# EAGLE design AK9753 Human Movement Sensor (EAGLE 9.5.2)
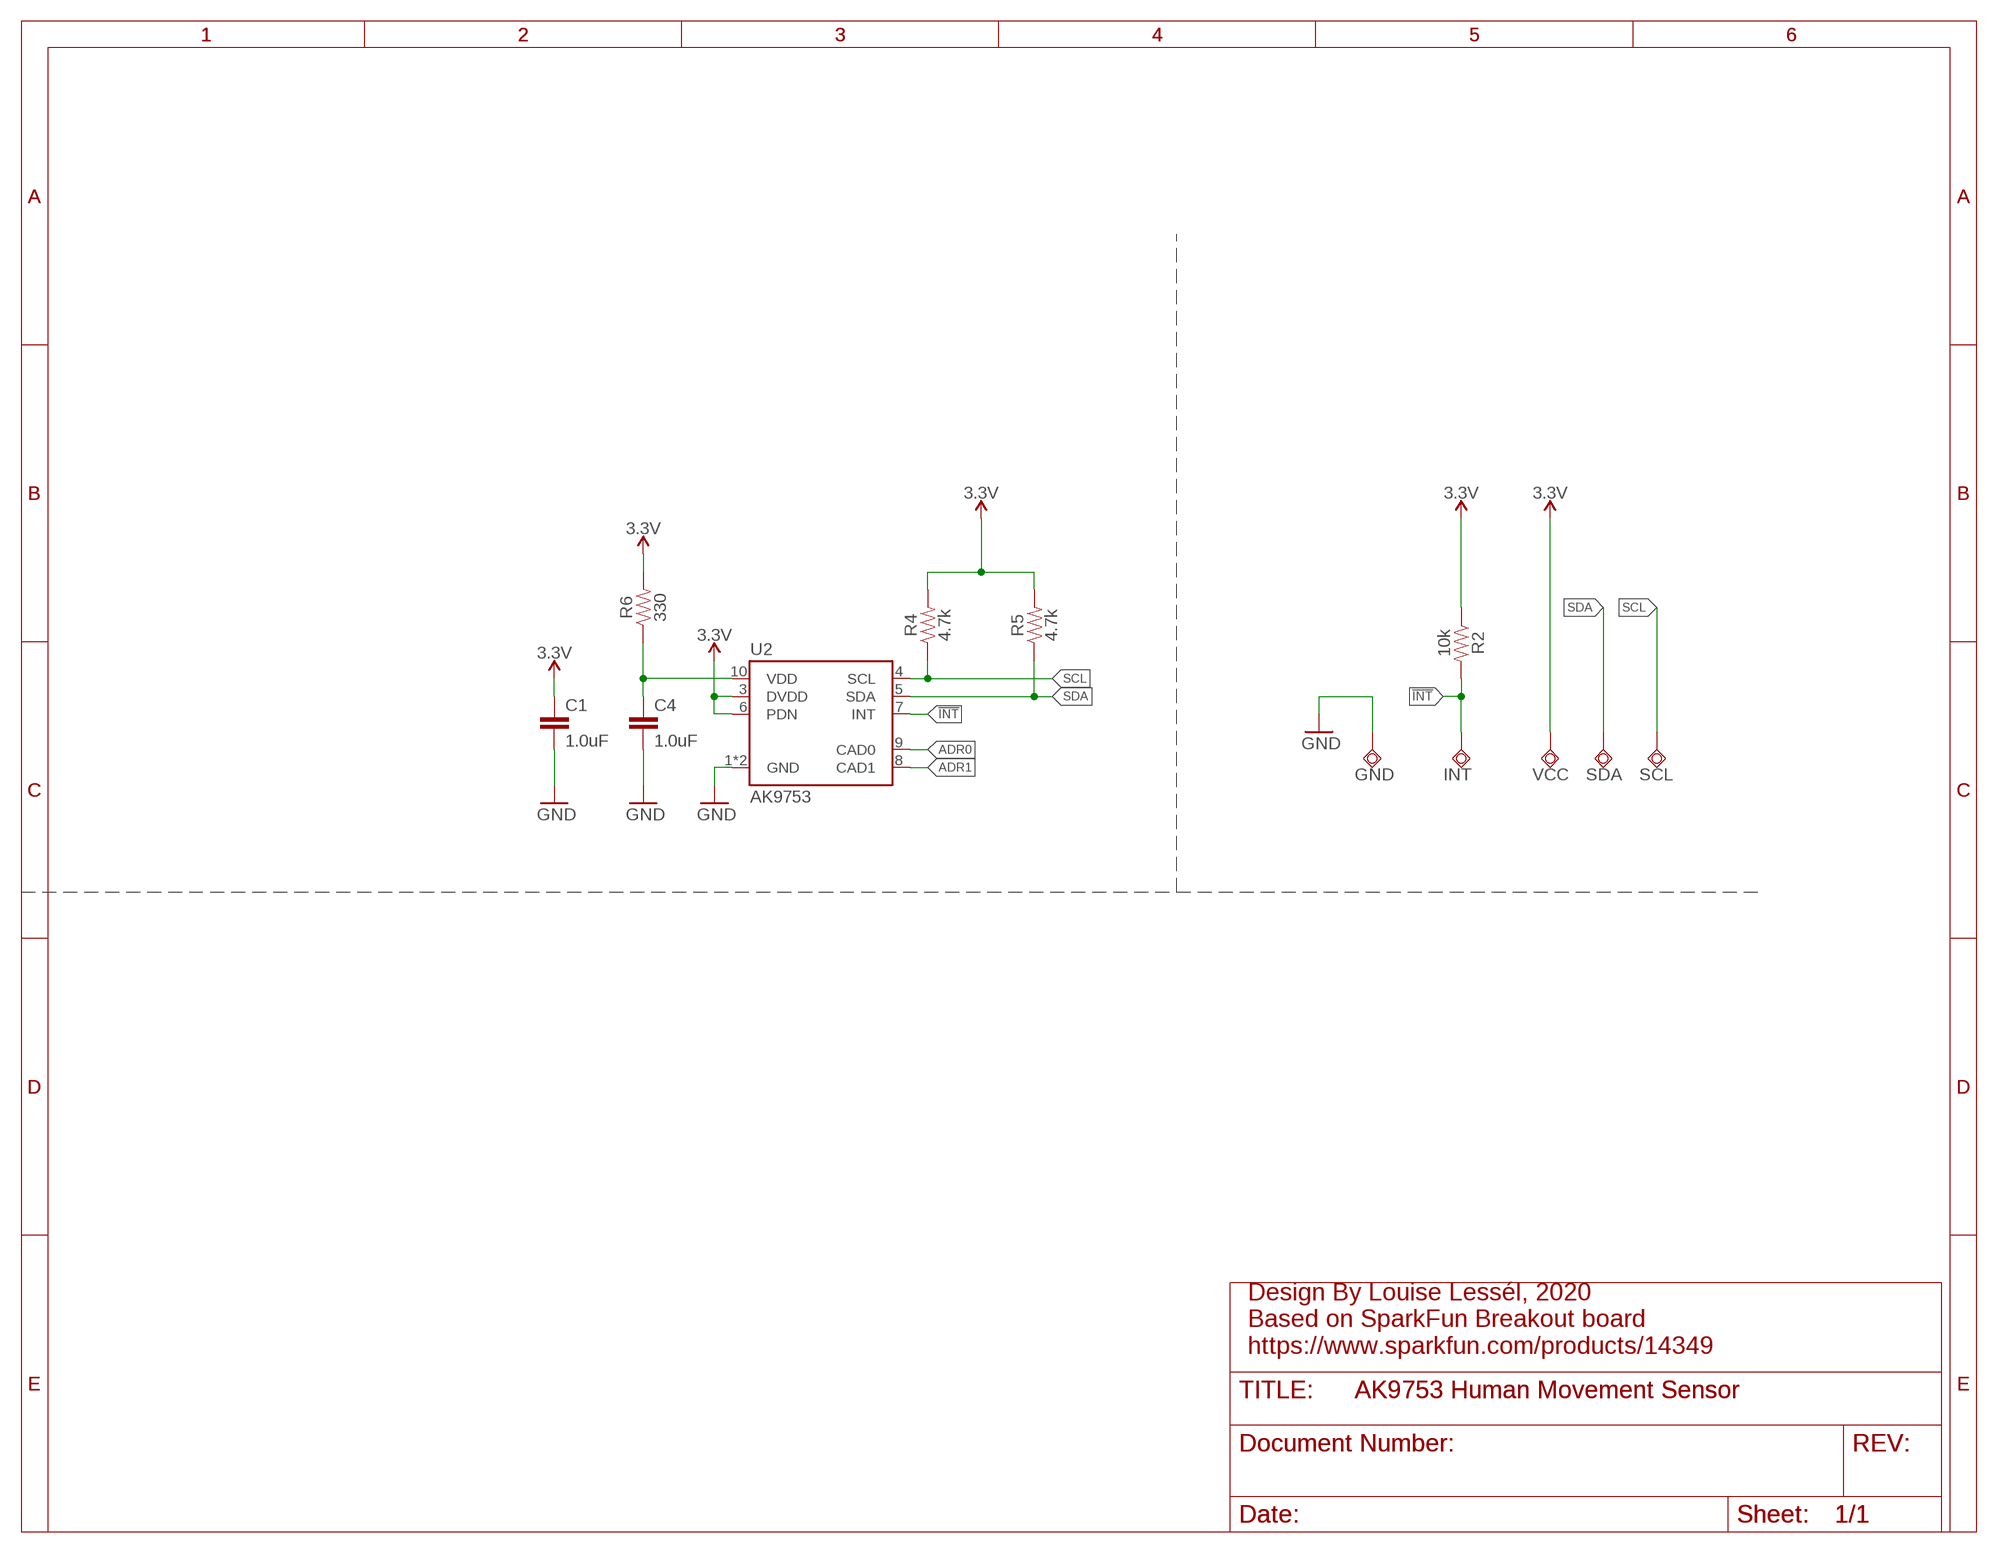
[diagram p0: schematic, sheet 1]

## Parts
C1  1.0uF  1.0UF-0603-16V-10%  [0603]
C4  1.0uF  1.0UF-0603-16V-10%  [0603]
GND  TPSQTP20R  [TP20R]
INT  TPSQTP20R  [TP20R]
R2  10k  10KOHM-0603-1/10W-1%  [0603]
R4  4.7k  4.7KOHM-0603-1/10W-1%  [0603]
R5  4.7k  4.7KOHM-0603-1/10W-1%  [0603]
R6  330  330OHM-0603-1/10W-1%  [0603]
SCL  TPSQTP20R  [TP20R]
SDA  TPSQTP20R  [TP20R]
U2  AK9753  AK9750"  [SON10]
VCC  TPSQTP20R  [TP20R]

## Nets
3.3V: C1.1 R2.1 R4.2 R5.2 R6.2 U2.3(DVDD) U2.6(PDN) VCC.TP
!INT: INT.TP R2.2 U2.7(INT)
ADR0: U2.9(CAD0)
ADR1: U2.8(CAD1)
GND: C1.2 C4.2 GND.TP U2.1(GND) U2.2(GND)
SCL: R4.1 SCL.TP U2.4(SCL)
SDA: R5.1 SDA.TP U2.5(SDA)
VDD: C4.1 R6.1 U2.10(VDD)

## Notes on the sheet
- Design By Louise Lessél, 2020
  Based on SparkFun Breakout board
  https://www.sparkfun.com/products/14349

## Library data of the parts
C1 C4 = SparkFun-Capacitors:1.0UF: 1µF ceramic capacitors A capacitor is a passive two-terminal electrical component used to store electrical energy temporarily in an electric field.; PROD_ID: CAP-00868
GND INT SCL SDA VCC = testpad:TPSQ: Test pad
R2 = SparkFun-Resistors:10KOHM: 10kΩ resistor A resistor is a passive two-terminal electrical component that implements electrical resistance as a circuit element. Resistors act to reduce current flow, and, at the same time, act to lower voltage levels within circuits. - Wikipedia; PROD_ID: RES-00824
R4 R5 = SparkFun-Resistors:4.7KOHM: 4.7kΩ resistor A resistor is a passive two-terminal electrical component that implements electrical resistance as a circuit element. Resistors act to reduce current flow, and, at the same time, act to lower voltage levels within circuits. - Wikipedia; PROD_ID: RES-07857
R6 = SparkFun-Resistors:330OHM: 330Ω resistor A resistor is a passive two-terminal electrical component that implements electrical resistance as a circuit element. Resistors act to reduce current flow, and, at the same time, act to lower voltage levels within circuits. - Wikipedia; PROD_ID: RES-00818
U2 = SparkFun-Sensors:AK9750: AK9750/AK9753 Human Movement Sensor; PROD_ID: SEN_13772

## Board
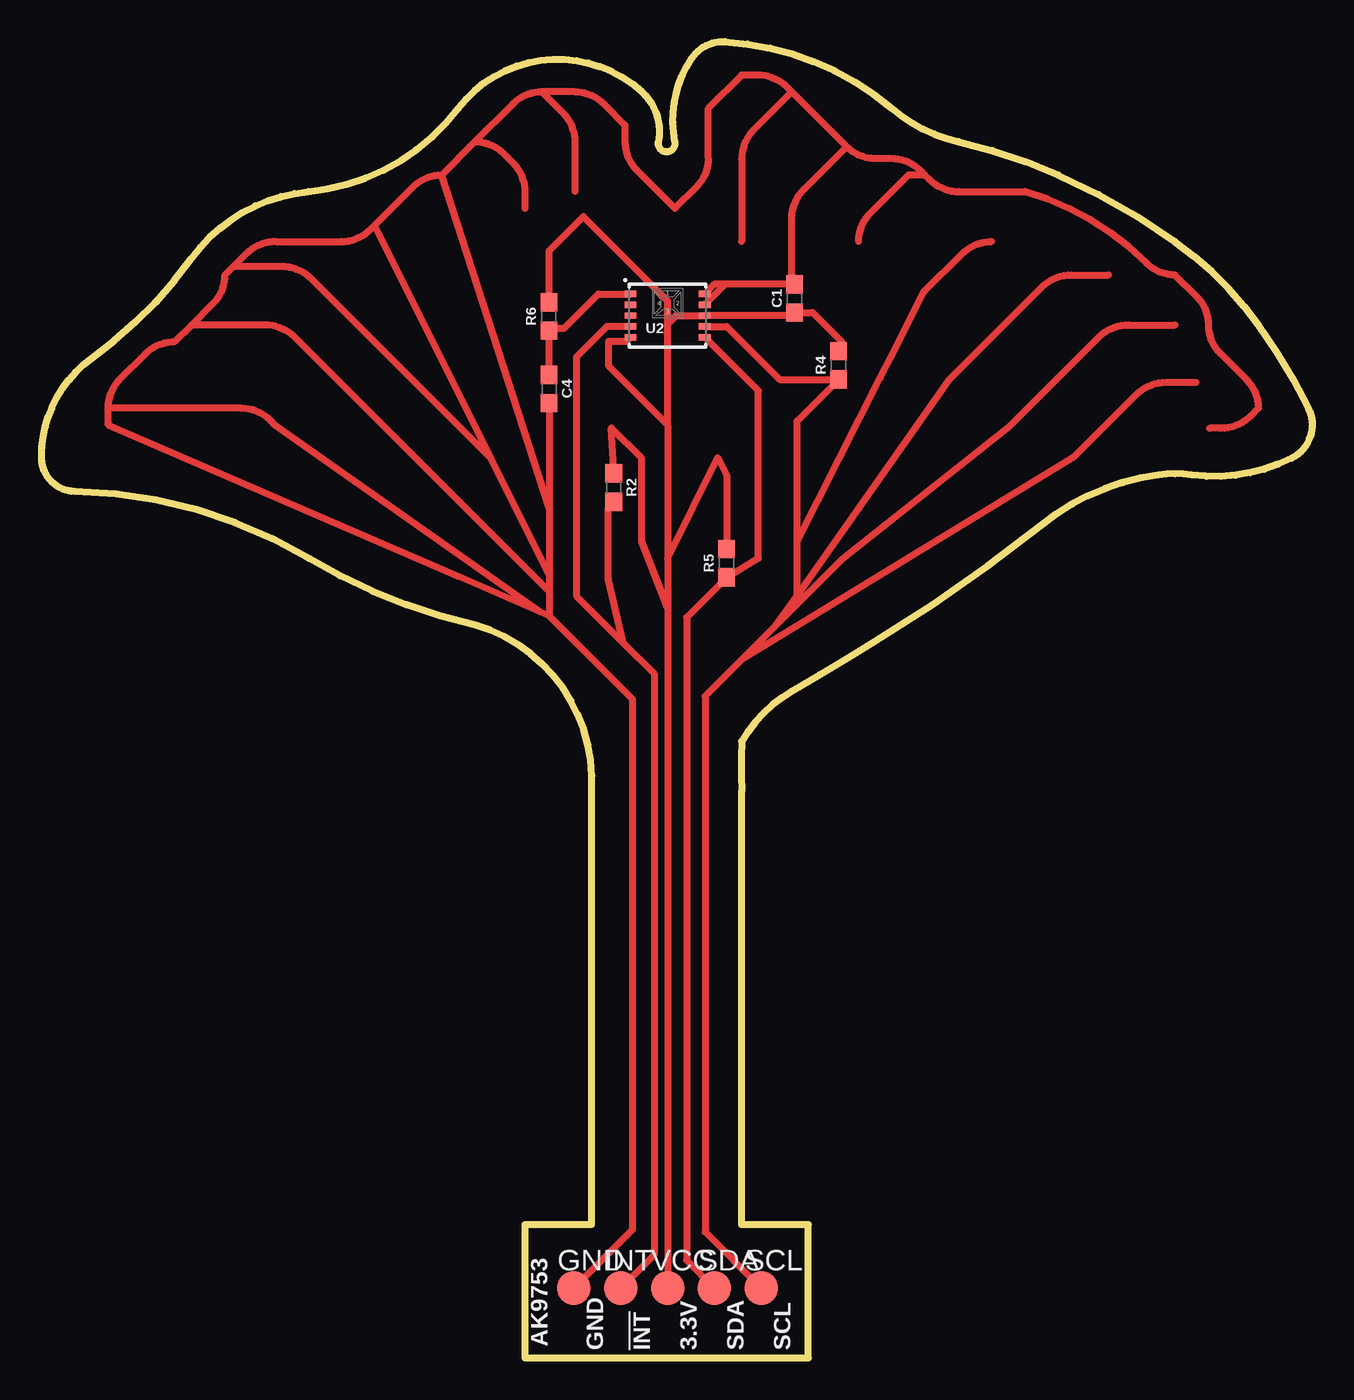
[diagram p1: board, top side]
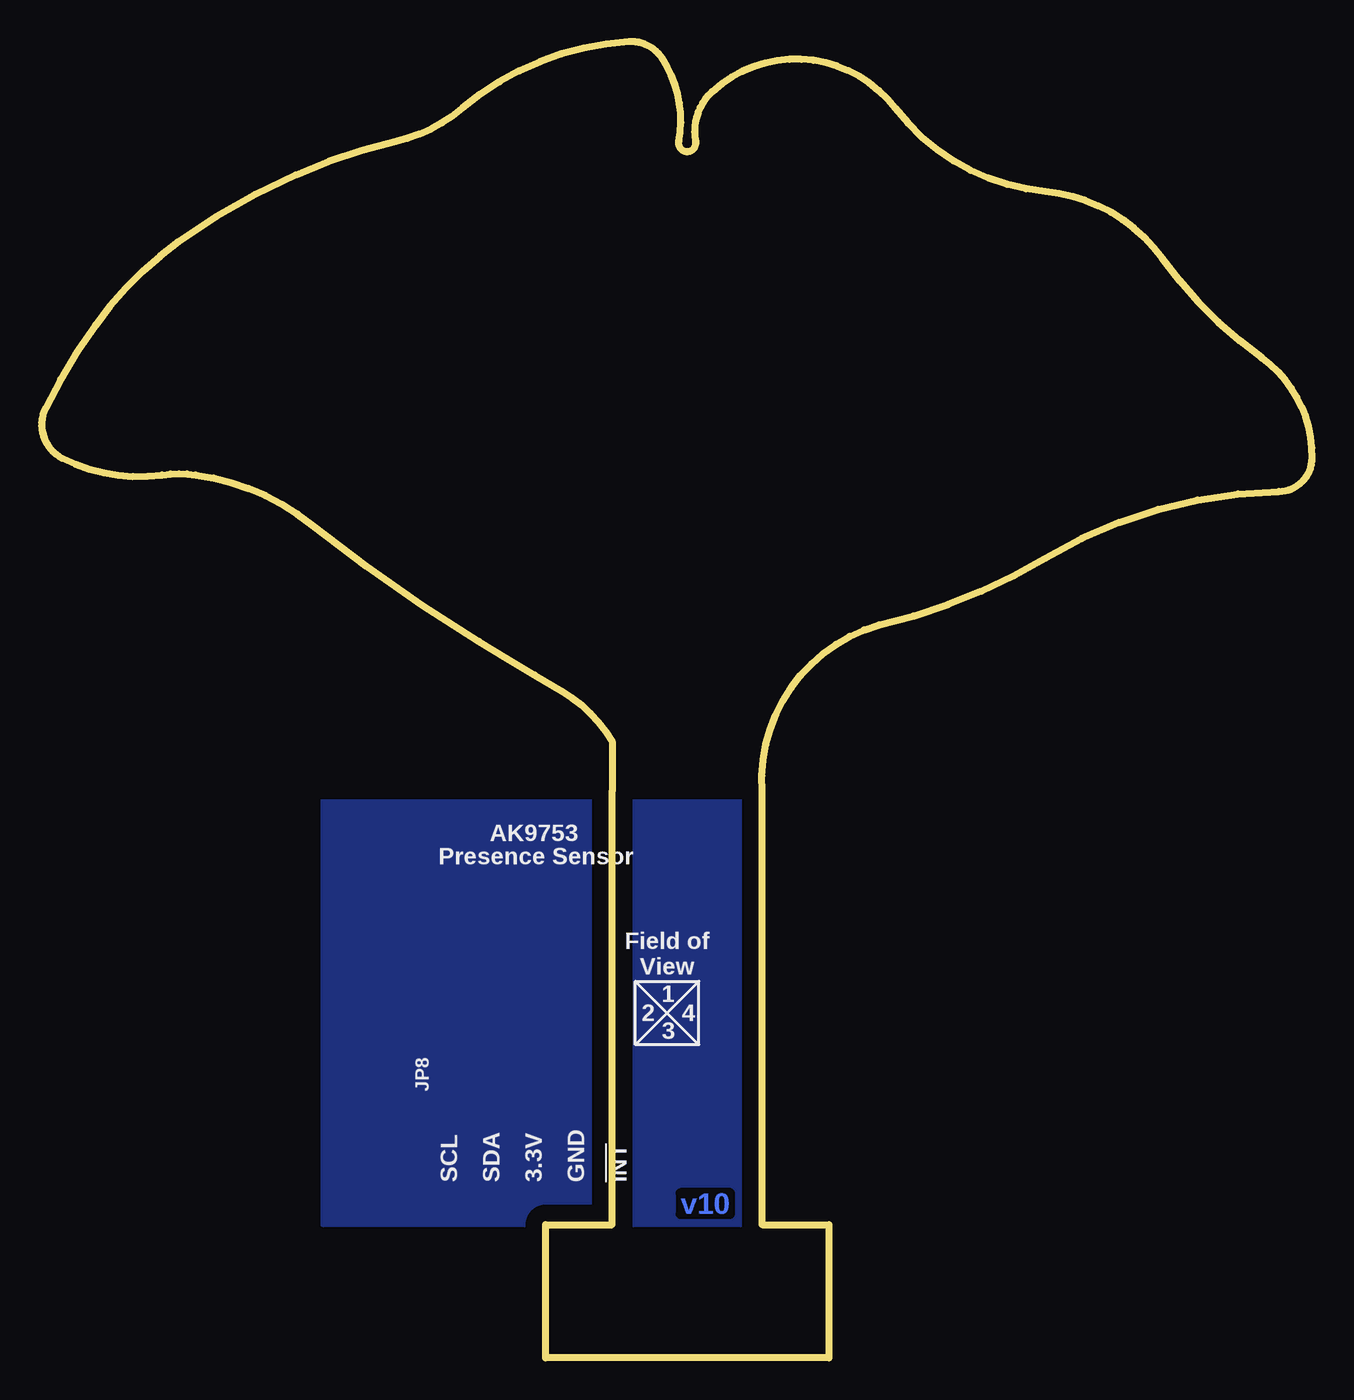
[diagram p2: board, bottom side, seen from below]

Size 76.23 x 79 mm. Coordinates in mm from the lower left corner, seen from the top.
Outline: 33,8 33,34 arc77 26,44 arc-18 16,48 arc30 2,52 arc-88 0,54 arc-55 3,60 arc18 9,66 arc-49 16,70 arc47 25,75 arc-95 36,76 arc-58 37,73 arc202 38,73 arc-44 39,78 arc-60 41,79 arc-37 51,75 arc27 55,73 arc-11 61,71 arc-12 68,67 arc-19 73,62 arc-9 76,57 arc-90 75,54 arc-35 69,53 arc16 67,53 arc31 60,50 arc-7 50,43 arc-1 45,40 arc29 42,37 arc2 42,34 42,8 46,8 46,0 29,0 29,8 33,8
Copper layers (1*16): Top 0.035mm / dielectric 1.5mm / Bottom 0.035mm
Design rules "default_OLD": minimum track width 6mil, minimum drill 0.35mm, track to track 6mil, track to pad 6mil, pad to pad 6mil, via to via 6mil, smd to smd 6mil, copper to edge 40mil, drill to drill 6mil, minimum pad ring 10mil, minimum via ring 8mil, stop-mask expansion 4mil, vias tented up to drill 0mil, thermal gap 10mil

### Footprints (pad centres in the part's own frame; a part is rotated, then mirrored left to right if it is on the bottom)
0603 = smd 1.1 x 1: 1 -0.85,0; 2 0.85,0
TP20R = smd 2 x 2: TP 0,0
SON10 = smd 0.7 x 0.38: 1 2.225,1.3; 2 2.225,0.65; 3 2.225,0; 4 2.225,-0.65; 5 2.225,-1.3; 6 -2.225,-1.3; 7 -2.225,-0.65; 8 -2.225,0; 9 -2.225,0.65; 10 -2.225,1.3

### Placement (x,y rotation side)
C1  45.18,63.59 90 top
C4  30.45,58.16 270 top
GND  31.94,4.19 0 top
INT  34.75,4.19 0 top
R2  34.32,52.24 270 top
R4  47.81,59.57 90 top
R5  41.1,47.7 90 top
R6  30.43,62.51 90 top
SCL  43.18,4.19 0 top
SDA  40.37,4.19 0 top
U2  37.56,62.56 0 top
VCC  37.56,4.19 0 top

### Tracks (layer width: path | path; a pad name or v marks a point on that pad's centre or on a via)
3.3V
  Top 0.406: 37.56,56 37.56,62.05 | C1.1 45,62.56 U2.3 38.07,62.56 37.56,62.05 | R5.2 41.1,52.97 40.56,54.03 37.56,47.98 | C1.1 45.33,62.89 | 37.56,56 37.56,47.98 | 37.56,47.98 37.56,45 | 37.56,45 VCC.TP | U2.6 35.08,61 34,61 34,59.56 37.56,56 | 37.56,45 36,49 36,54 34.18,55.82 34.32,53.38 R2.1 | C1.1 46.26,62.74 48,61 48,60.61 R4.2 | 37.56,62.05 37.56,63.44 32.5,68.5 30.43,66.43 R6.2
!INT
  Top 0.406: 34.91,42.91 32.08,45.73 32.08,60.08 33.91,61.91 U2.7 | 34.91,42.91 36.75,41.06 36.75,6.19 INT.TP | 34.91,42.91 34,46.75 34,51 R2.2
GND
  Top 0.406: 41.02,64.44 C1.2 45.18,64.56 arc45 45,65 45,68.36 arc-45 45.74,70.16 48.29,72.71 | 41.02,64.44 40.37,64.44 U2.1 | U2.2 41.02,64.44 | C4.2 30.45,51 | 30.45,51 30.45,47 | 30.45,47 30.45,46 | 30.45,46 30.45,44.54 | GND.TP 35.45,7.7 35.45,39.54 30.45,44.54 | 30.45,44.54 29.9,44.78 | 29.9,44.78 24.96,46.92 4,56 4,57 | 30.45,47 26.97,53.99 | 26.97,53.99 20,68 | 30.45,51 24,71 | 4,57 arc-45 4.74,58.8 6.2,60.26 arc-45 8,61 9,62 | 9,62 10.29,63.29 arc45 11,65 11.5,65.5 | 11.5,65.5 12.26,66.26 arc-45 14.05,67 17.95,67 arc45 19.74,67.74 20,68 | 20,68 22.29,70.29 arc-45 24,71 | 30,76 arc45 28.29,75.29 26,73 | 30,76 31.95,76 arc-45 33.74,75.26 35,74 35,73 arc45 35.71,71.29 38,69 39.29,70.29 arc45 40,72 40,75 42,77 42.95,77 arc-45 44.74,76.26 45,76 | 24,71 26,73 | 45,76 48.29,72.71 | 48.29,72.71 arc45 50,72 50.95,72 arc-45 52.74,71.26 53,71 | 53,71 53.26,70.74 arc45 55.05,70 59,70 arc-29 66.29,65.71 arc45 68,65 69.29,63.71 arc-45 70,62 arc45 70.71,60.29 72.29,58.71 arc-45 73,57 72.54,56.54 arc-45 70.74,55.79 70.09,55.79 | 30.45,46 15.19,61.26 arc45 13.4,62 9,62 | 26.97,53.99 16.2,64.76 arc45 14.41,65.5 11.5,65.5 | 29.9,44.78 14,56 13.74,56.26 arc45 11.95,57 4,57 | 26,73 arc-45 27.71,72.29 28.26,71.74 arc-45 29,69.95 29,69 | 32,70 32,72.95 arc45 31.26,74.74 30,76 | 45,76 42.74,73.74 arc45 42,71.95 42,67 | 53,71 52,71 49.71,68.71 arc45 49,67
  pour Bottom (isolate 0.305): 34,8 34,33.4 59.4,33.4 59.4,8
SCL
  Top 0.406: U2.4 41.09,61.91 44.28,58.72 R4.1 45.33,56.23 45.33,49 | 44.05,43.95 48.05,47.95 58.07,55.91 63.41,61.26 arc-45 65.21,62 68,62 | 42.05,41.95 44.05,43.95 | 42.05,41.95 39.81,39.72 39.81,7.55 SCL.TP | 42.05,41.95 61.95,54.09 65.67,57.81 arc-45 67.47,58.56 69.27,58.56 | 44.05,43.95 45.33,45.77 | 45.33,45.77 54.44,58.69 60,64.26 arc-45 61.8,65 64,65 | 45.33,45.77 45.33,49 | 45.33,49 50.33,58.83 50.94,60.03 52.97,64.02 55.22,66.26 arc-45 57,67
SDA
  Top 0.406: SDA.TP 38.7,5.86 38.7,44.45 R5.1 43,48 43,58.04 U2.5
VDD
  Top 0.406: C4.1 30.45,61.65 R6.1 30.58,61.81 31.35,61.81 33.4,63.86 U2.10

### Text on the board
Bottom: v10
tPlace: AK9753 | GND | !INT | 3.3V | SDA | SCL
bPlace: AK9753 | Presence Sensor | Field of / View | 1 | 4 | 2 | 3 | JP8 | !INT | GND | 3.3V | SDA | SCL